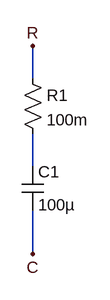
[diagram p0: schematic My_capacitor.asc]
My_capacitor.asc, the LTspice schematic file:
Version 4
SHEET 1 880 680
WIRE 176 48 176 0
WIRE 176 176 176 128
WIRE 176 304 176 240
FLAG 176 0 R
FLAG 176 304 C
SYMBOL cap 160 176 R0
SYMATTR InstName C1
SYMATTR Value 100µ
SYMBOL res 160 32 R0
SYMATTR InstName R1
SYMATTR Value 100m

The netlist it stands for:
* My_capacitor.asc
C1 N001 C 100µ
R1 R N001 100m
.backanno
.end